# EasyEDA Pro project ProPrj_3x3motorFPGA_V2_1_2025-08-05.epro, board PCB1
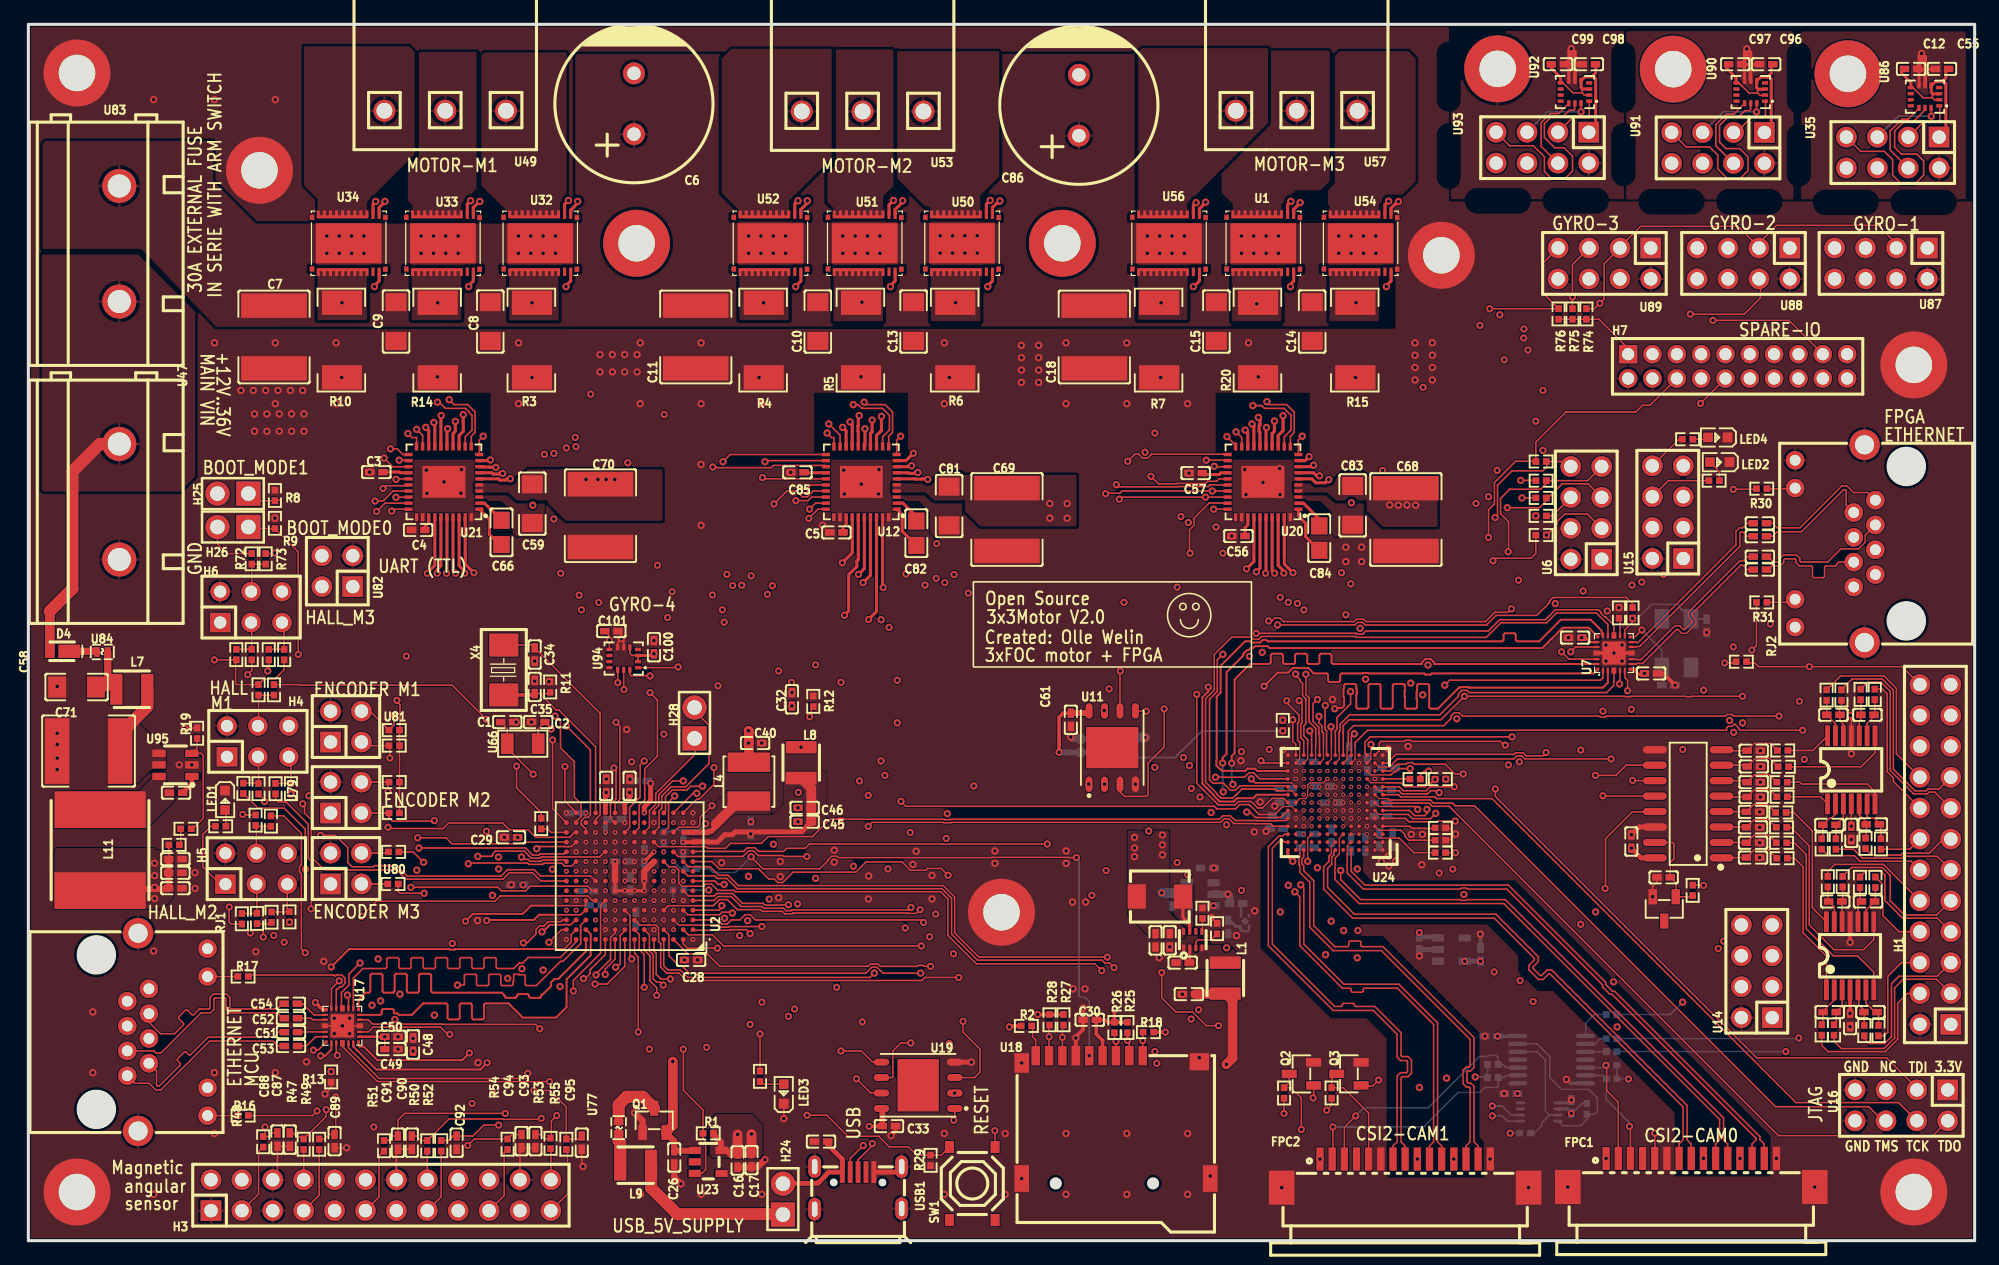
[diagram p6: board, top side]
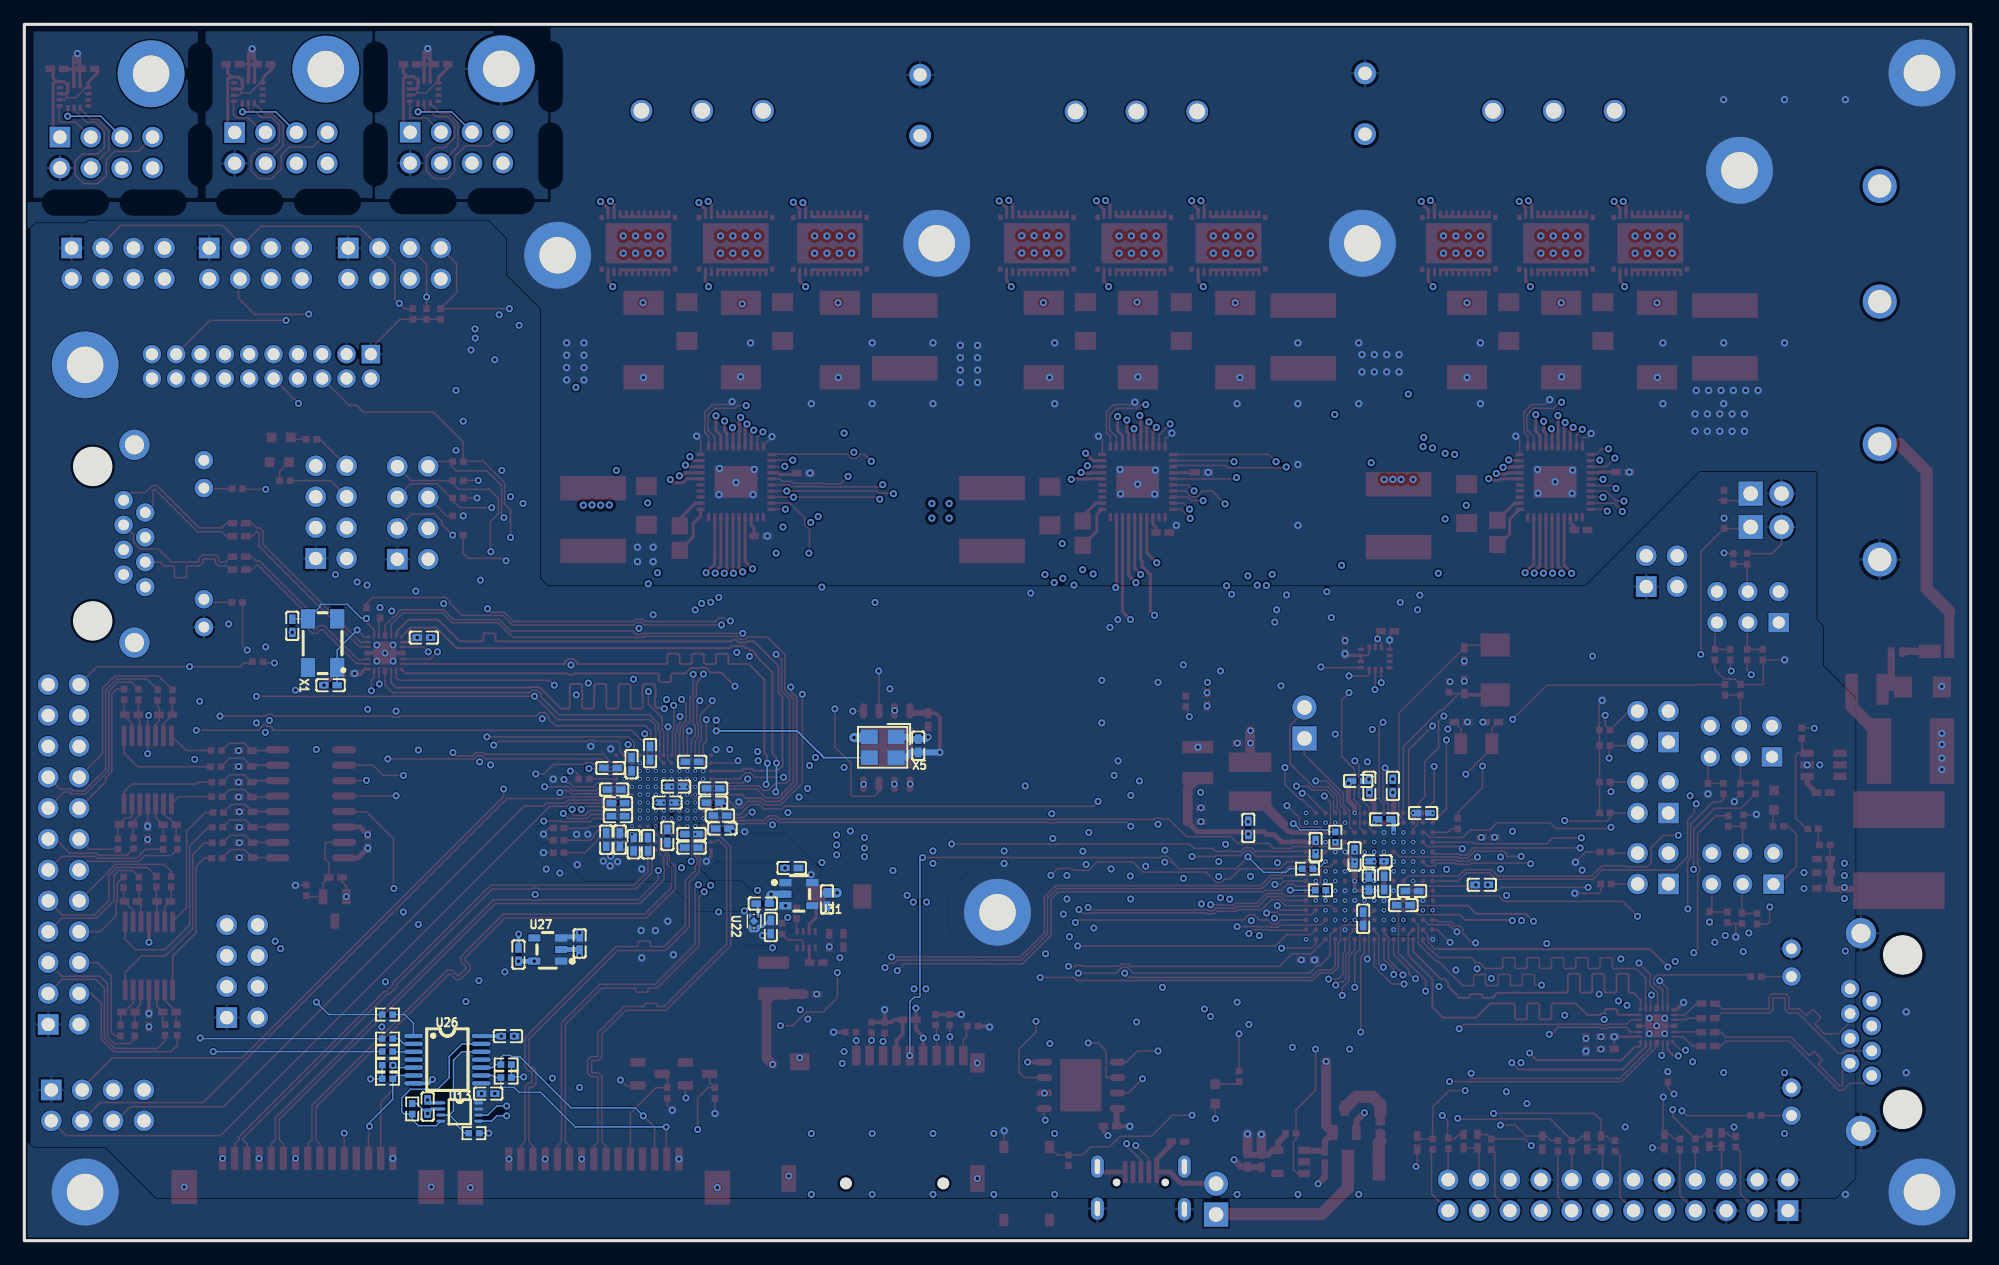
[diagram p7: board, bottom side, seen from below]

Outline 160 x 100 mm; copper layers: Top Layer, Inner1, Inner2, Inner3, Inner4, Bottom Layer. Coordinates in mm from the lower left corner of the outline.
Outline path: rectangle 0,100 160,0
Stack: Top Layer 0.035mm Outer layer thickness 1oz / Dielectric1 0.0994mm 3313 RC57% 4.2mil / Inner1 0.0152mm Inner layer thickness / Dielectric2 0.55mm 0.55mm H/H No copper / Inner2 0.0152mm Inner layer thickness / Dielectric3 0.1088mm 2116 RC54% 4.9mil / Inner3 0.0152mm Inner layer thickness / Dielectric4 0.55mm 0.55mm H/H No copper / Inner4 0.0152mm Inner layer thickness / Dielectric5 0.0994mm 3313 RC57% 4.2mil / Bottom Layer 0.035mm Outer layer thickness 1oz

## Design rules (mm)
net CCM_CLK1_P: CCM_CLK1
net CCM_CLK1_N: CCM_CLK1
net $1I162614\CAM0_D0_N: DP1
net $1I162614\CAM0_D0_P: DP1
net $1I162614\CAM0_D1_P: DP2
net $1I162614\CAM0_D1_N: DP2
net $1I162614\CAM0_CLK_N: DP3
net $1I162614\CAM0_CLK_P: DP3
net $1I162614\CAM1_D1_P: $1I162614\CAM1_D1
net $1I162614\CAM1_D1_N: $1I162614\CAM1_D1
net $1I162614\CAM1_D0_N: DP4
net $1I162614\CAM1_D0_P: DP4
net $1I162614\CAM1_CLK_N: $1I162614\CAM1_CLK
net $1I162614\CAM1_CLK_P: $1I162614\CAM1_CLK
net $1I162614\ETH-F-RD_P: $1I162614\ETH-F-RD
net $1I162614\ETH-FX-RD_P: $1I162614\ETH-FX-RD
net $1I162614\ETH-F-RD_N: $1I162614\ETH-F-RD
net $1I162614\ETH-FX-RD_N: $1I162614\ETH-FX-RD
net $1I162614\ETH-F-TD_N: $1I162614\ETH-F-TD
net $1I162614\ETH-FX-TD_N: $1I162614\ETH-FX-TD
net $1I162614\ETH-F-TD_P: $1I162614\ETH-F-TD
net $1I162614\ETH-FX-TD_P: $1I162614\ETH-FX-TD
net ETH-M-TD_N: ETH-M-TD
net ETH-MX-TD_N: ETH-MX-TD
net ETH-M-RD_P: ETH-M-RD
net ETH-MX-RD_P: ETH-MX-RD
net ETH-M-TD_P: ETH-M-TD
net ETH-MX-TD_P: ETH-MX-TD
net ETH-M-RD_N: ETH-M-RD
net ETH-MX-RD_N: ETH-MX-RD
template: Custom Config
spacing copperThickness1oz (default): track to track 0.127, other pairs 0.127 to 0.3
spacing copperThickness2oz: track to track 0.203, other pairs 0.152 to 0.3
spacing BGA_065_SPACE: track to track 0.105, other pairs 0.1 to 0.3
spacing BGA_08_SPACE: track to track 0.11, other pairs 0.105 to 0.3
track width copperThickness1oz (default): min 0.1, default 0.127, max 2.54
track width copperThickness2oz: min 0.203, default 0.254, max 2.54
track width 50ohm_sing_L1_L2: min 0.1, default 0.157, max 0.25
differential pair differentialPair (default): width min 0.127, default 0.254, max 2.54; gap min 0.152, default 0.152
differential pair differentialPair100ohm_L1_L2: width min 0.1, default 0.122, max 0.127; gap min 0.1, default 0.203
via viaSize (default): diameter min 0.2, default 0.35, max 10; hole min 0.2, default 0.35, max 6.3
net 36V uses copperRegion_36V
net CCM_CLK1_P uses differentialPair100ohm_L1_L2
net CCM_CLK1_N uses differentialPair100ohm_L1_L2
net $1N29938 uses copperRegion_36V
net GND-1 uses copperRegion_36V
net GND-3 uses copperRegion_36V
net ETH_TX_D1 uses 50ohm_sing_L1_L2
net ETH_TX_D0 uses 50ohm_sing_L1_L2
net ETH_XI uses 50ohm_sing_L1_L2
net ETH_RX_D1 uses 50ohm_sing_L1_L2
net ETH_RX_D0 uses 50ohm_sing_L1_L2
net $1I162614\CAM0_D0_N uses differentialPair100ohm_L1_L2
net $1I162614\CAM0_D0_P uses differentialPair100ohm_L1_L2
net $1I162614\CAM0_D1_P uses differentialPair100ohm_L1_L2
net $1I162614\CAM0_D1_N uses differentialPair100ohm_L1_L2
net $1I162614\CAM0_CLK_N uses differentialPair100ohm_L1_L2
net $1I162614\CAM0_CLK_P uses differentialPair100ohm_L1_L2
net $1I162614\CAM1_D1_P uses differentialPair100ohm_L1_L2
net $1I162614\CAM1_D1_N uses differentialPair100ohm_L1_L2
net $1I162614\CAM1_D0_N uses differentialPair100ohm_L1_L2
net $1I162614\CAM1_D0_P uses differentialPair100ohm_L1_L2
net $1I162614\F-ETH-CLK_OUT uses 50ohm_sing_L1_L2
net $1I162614\CAM1_CLK_N uses differentialPair100ohm_L1_L2
net $1I162614\CAM1_CLK_P uses differentialPair100ohm_L1_L2
net $1I162614\F-ETH_TX_D0 uses 50ohm_sing_L1_L2
net $1I162614\F-ETH_RX_D1 uses 50ohm_sing_L1_L2
net $1I162614\F-ETH_TX_D1 uses 50ohm_sing_L1_L2
net $1I162614\F-ETH_RX_D0 uses 50ohm_sing_L1_L2
net $1I162614\ETH-F-RD_P uses differentialPair100ohm_L1_L2
net $1I162614\ETH-FX-RD_P uses differentialPair100ohm_L1_L2
net $1I162614\ETH-F-RD_N uses differentialPair100ohm_L1_L2
net $1I162614\ETH-FX-RD_N uses differentialPair100ohm_L1_L2
net $1I162614\ETH-F-TD_N uses differentialPair100ohm_L1_L2
net $1I162614\ETH-FX-TD_N uses differentialPair100ohm_L1_L2
net $1I162614\ETH-F-TD_P uses differentialPair100ohm_L1_L2
net $1I162614\ETH-FX-TD_P uses differentialPair100ohm_L1_L2
net ETH-M-TD_N uses differentialPair100ohm_L1_L2
net ETH-MX-TD_N uses differentialPair100ohm_L1_L2
net ETH-M-RD_P uses differentialPair100ohm_L1_L2
net ETH-MX-RD_P uses differentialPair100ohm_L1_L2
net ETH-M-TD_P uses differentialPair100ohm_L1_L2
net ETH-MX-TD_P uses differentialPair100ohm_L1_L2
net ETH-M-RD_N uses differentialPair100ohm_L1_L2
net ETH-MX-RD_N uses differentialPair100ohm_L1_L2
diff pair CCM_CLK1 uses differentialPair100ohm_L1_L2
diff pair DP1 uses differentialPair100ohm_L1_L2
diff pair DP2 uses differentialPair100ohm_L1_L2
diff pair DP3 uses differentialPair100ohm_L1_L2
diff pair $1I162614\CAM1_D1 uses differentialPair100ohm_L1_L2
diff pair DP4 uses differentialPair100ohm_L1_L2
diff pair $1I162614\CAM1_CLK uses differentialPair100ohm_L1_L2
diff pair $1I162614\ETH-F-RD uses differentialPair100ohm_L1_L2
diff pair $1I162614\ETH-FX-RD uses differentialPair100ohm_L1_L2
diff pair $1I162614\ETH-F-TD uses differentialPair100ohm_L1_L2
diff pair $1I162614\ETH-FX-TD uses differentialPair100ohm_L1_L2
diff pair ETH-M-TD uses differentialPair100ohm_L1_L2
diff pair ETH-MX-TD uses differentialPair100ohm_L1_L2
diff pair ETH-M-RD uses differentialPair100ohm_L1_L2
diff pair ETH-MX-RD uses differentialPair100ohm_L1_L2
['net', '36v'] ['NET', '3.3V-1'] uses default
pour e3166 uses copperRegion_36V
pour e3154 uses copperRegion_36V
pour e3189 uses copperRegion_36V
pour e3203 uses copperRegion_36V
pour e3228 uses copperRegion_36V
pour e3209 uses copperRegion_36V
pour e3242 uses copperRegion_36V
pour e3249 uses copperRegion_36V
pour e3261 uses copperRegion_36V
pour e3272 uses copperRegion_36V
pour e9346 uses GND_top
region e1839 uses BGA-OUTER_L1-L6-PLANE, BGA_065_SPACE
region e5712 uses BGA-08P-PLANE, BGA_08_SPACE
region e19858 uses BGA-065P-PLANE, BGA_065_SPACE
region e33163 uses BGA-065P-PLANE, BGA_065_SPACE
region e35975 uses BGA-065P-PLANE, BGA_065_SPACE
region e35976 uses BGA-065P-PLANE, BGA_065_SPACE
region e35977 uses BGA-OUTER_L1-L6-PLANE, BGA_065_SPACE
region e35979 uses BGA-OUTER_L1-L6-PLANE, BGA_08_SPACE
region e35980 uses BGA-08P-PLANE, BGA_08_SPACE
pour e15641 uses copperRegion
pour e15643 uses copperRegion
pour e8131 uses copperRegion
pour e18376 uses copperRegion
pour e18377 uses copperRegion
pour e13086 uses copperRegion
pour e18975 uses copperRegion
pour e18976 uses copperRegion
pour e13683 uses copperRegion
pour e17779 uses copperRegion
pour e17780 uses copperRegion
pour e12193 uses copperRegion
pour e14351 uses copperRegion
pour e16438 uses copperRegion
pour e16439 uses copperRegion
pour e15000 uses copperRegion
pour e6384 uses copperRegion
pour e17177 uses copperRegion
pour e17178 uses copperRegion
pour e11628 uses copperRegion

## Placement (name value [footprint] x y rotation side)
C1  12pF  [C0402]  39.37 42.64 0 top
C2  12pF  [C0402]  41.91 42.64 180 top
C3  100nF  [C0402]  28.61 63.19 180 top
C4  4.7uF  [C0402]  32.04 58.43 180 top
C5  4.7uF  [C0402]  66.42 58.23 180 top
C6  1000uF  [CAP-TH_BD13.0-P5.00-D0.6-FD]  49.78 93.47 90 top
C7  22uF  [C2220]  20.19 74.3 90 top
C8  1uF  [C1206]  37.97 75.56 90 top
C9  1uF  [C1206]  30.23 75.56 90 top
C10  1uF  [C1206]  64.9 75.56 90 top
C11  22uF  [C2220]  54.86 74.3 90 top
C12  4.7uF  [C0402]  154.77 96.34 180 top
C13  1uF  [C1206]  72.77 75.56 90 top
C14  1uF  [C1206]  105.54 75.56 90 top
C15  1uF  [C1206]  97.66 75.56 90 top
C16  4.7uF  [C0402]  58.3 6.59 90 top
C17  4.7uF  [C0402]  59.45 6.62 90 top
C18  22uF  [C2220]  87.63 74.3 90 top
C19  100nF  [C0402]  49.94 26.47 90 bottom
C20  100nF  [C0402]  46.63 27.58 0 bottom
C21  100nF  [C0402]  45.01 35.15 0 bottom
C22  100nF  [C0402]  45.92 28.75 0 bottom
C23  100nF  [C0402]  40.18 29.26 0 bottom
C24  100nF  [C0402]  50.65 31.6 270 bottom
C25  100nF  [C0402]  50.34 37.8 0 bottom
C26  100nF  [C0402]  53.1 6.84 90 top
C27  4.7uF  [C0402]  65.16 8.15 0 top
C28  100nF  [C0402]  54.48 23.08 180 top
C29  4.7uF  [C0402]  39.68 33.17 0 top
C30  100nF  [C0402]  87.25 18.16 180 top
C31  100nF  [C0402]  48.21 34.65 180 bottom
C32  100nF  [C0402]  62.77 44.51 90 top
C33  100nF  [C0402]  70.75 9.42 0 top
C34  12pF  [C0402]  41.62 48.19 270 top
C35  12pF  [C0402]  41.62 45.52 90 top
C36  4.7uF  [C0402]  47.5 37.39 270 bottom
C37  100nF  [C0402]  47.5 37.39 270 top
C38  4.7uF  [C0402]  49.43 37.39 270 top
C39  100nF  [C0402]  49.43 37.39 270 bottom
C40  4.7uF  [C0402]  59.74 40.91 0 top
C41  4.7uF  [C0402]  48.21 29.41 90 bottom
C42  4.7uF  [C0402]  48.77 31.19 0 bottom
C43  100nF  [C0402]  49.48 29.36 90 bottom
C44  4.7uF  [C0402]  53.85 32.36 270 bottom
C45  4.7uF  [C0402]  63.82 34.44 180 top
C46  4.7uF  [C0402]  63.82 35.59 180 top
C47  100nF  [C0402]  59.38 33.93 90 bottom
C48  4.7uF  [C0402]  31.62 16.13 90 top
C49  4.7uF  [C0402]  29.84 15.75 0 top
C50  100nF  [C0402]  29.84 16.76 0 top
C51  33nF  [C0402]  21.59 17.15 0 top
C52  33nF  [C0402]  21.59 18.29 0 top
C53  33nF  [C0402]  21.59 16 0 top
C54  33nF  [C0402]  21.57 19.48 0 top
C55  100nF  [C0402]  157.31 96.34 0 top
C56  4.7uF  [C0402]  99.47 57.93 180 top
C57  100nF  [C0402]  95.96 63.11 180 top
C58  1uF  [C1206]  3.96 45.52 0 top
C59  1uF  [C1206]  41.43 60.59 90 top
C60  4.7uF  [C0402]  12.09 30.24 0 top
C61  100nF  [C0402]  85.7 42.82 270 top
C62  4.7uF  [C0402]  12.09 31.37 0 top
C63  4.7uF  [C0402]  12.09 28.97 0 top
C64  100nF  [C0402]  12.14 36.83 180 top
C65  4.7uF  [C0402]  94.89 22.86 0 top
C66  22nF  [C0805]  38.89 58.23 90 top
C67  4.7uF  [C0402]  92.66 24.69 90 top
C68  22uF  [C2220]  113.24 59.28 270 top
C69  22uF  [C2220]  80.45 59.29 270 top
C70  22uF  [C2220]  47.03 59.6 270 top
C71  22uF  [C2220]  4.95 40.25 0 top
C72  4.7uF  [C0402]  93.83 24.69 90 top
C73  100nF  [C0402]  95.4 20.27 180 top
C74  100nF  [C0402]  114.35 24.44 270 bottom
C75  4.7uF  [C0402]  119.38 23.52 270 bottom
C76  100nF  [C0402]  94.02 28.05 90 bottom
C77  4.7uF  [C0402]  96.92 30.64 180 bottom
C78  100nF  [C0402]  98.63 25.79 270 bottom
C79  4.7uF  [C0402]  99.29 27.72 0 bottom
C80  100nF  [C0402]  121.87 12.09 0 bottom
C81  1uF  [C1206]  75.69 60.4 90 top
C82  22nF  [C0805]  73 58.17 90 top
C83  1uF  [C1206]  108.86 60.45 90 top
C84  22nF  [C0805]  106.12 57.76 90 top
C85  100nF  [C0402]  63.22 63.17 180 top
C86  1000uF  [CAP-TH_BD13.0-P5.00-D0.6-FD]  86.36 93.34 90 top
C87  4.7nF  [C0402]  21.49 8.31 270 top
C88  4.7nF  [C0402]  20.47 8.31 270 top
C89  4.7nF  [C0402]  25.17 8.18 270 top
C90  4.7nF  [C0402]  31.52 8.06 270 top
C91  4.7nF  [C0402]  30.38 8.06 270 top
C92  4.7nF  [C0402]  35.21 8.06 270 top
C93  4.7nF  [C0402]  41.68 8.18 270 top
C94  4.7nF  [C0402]  40.54 8.18 270 top
C95  4.7nF  [C0402]  45.49 8.06 270 top
C96  100nF  [C0402]  142.86 96.72 0 top
C97  4.7uF  [C0402]  140.32 96.72 180 top
C98  100nF  [C0402]  128.28 96.72 0 top
C99  4.7uF  [C0402]  125.74 96.72 180 top
C100  100nF  [C0402]  51.43 48.79 270 top
C101  4.7uF  [C0402]  47.92 50.11 180 top
C102  4.7uF  [C0402]  127.15 49.58 180 bottom
C103  4.7uF  [C0402]  133.4 46.63 0 top
C104  100nF  [C0402]  127.15 49.58 180 top
C105  33nF  [C0402]  142.34 56.24 180 top
C106  33nF  [C0402]  142.34 55.17 180 top
C107  33nF  [C0402]  142.34 57.91 180 top
C108  33nF  [C0402]  142.34 58.98 180 top
C109  12pF  [C0402]  137.97 50.55 90 bottom
C110  12pF  [C0402]  134.82 45.67 180 bottom
C111  100nF  [C0402]  86.51 40.69 90 bottom
C112  100nF  [C0402]  149.76 18.14 270 top
C113  100nF  [C0402]  148.08 18.8 0 top
C114  100nF  [C0402]  151.43 18.8 180 top
C115  4.7uF  [C0402]  134.43 29.87 180 top
C116  100nF  [C0402]  151.23 27.89 180 top
C117  100nF  [C0402]  131.77 32.82 270 top
C118  100nF  [C0402]  148.54 27.89 0 top
C119  100nF  [C0402]  149.86 33.53 270 top
C120  100nF  [C0402]  141.83 40.28 0 top
C121  100nF  [C0402]  141.84 38.98 0 top
C122  100nF  [C0402]  141.83 37.69 0 top
C123  100nF  [C0402]  141.83 36.47 0 top
C124  100nF  [C0402]  141.78 35.25 0 top
C125  100nF  [C0402]  141.78 33.98 0 top
C126  100nF  [C0402]  141.78 32.72 0 top
C127  100nF  [C0402]  141.78 31.5 0 top
C128  100nF  [C0402]  148.06 34.19 0 top
C129  100nF  [C0402]  151.63 34.23 180 top
C130  100nF  [C0402]  151.18 43.23 180 top
C131  100nF  [C0402]  148.39 43.23 0 top
C132  4.7uF  [C0402]  109.91 32.59 90 bottom
C133  100nF  [C0402]  103.38 36.02 180 bottom
C134  100nF  [C0402]  111.2 35.97 0 bottom
C135  4.7uF  [C0402]  105.16 33.43 0 bottom
C136  4.7uF  [C0402]  102.62 33.88 0 bottom
C137  100nF  [C0402]  102.82 34.95 180 bottom
C138  4.7uF  [C0402]  107.14 33.27 90 bottom
C139  100nF  [C0402]  105.16 32.31 180 bottom
C140  4.7uF  [C0402]  107.14 36.02 180 bottom
C141  100nF  [C0402]  108.73 32.59 270 bottom
C142  100nF  [C0402]  111.81 38.86 0 bottom
C143  100nF  [C0402]  111.05 32.97 270 bottom
C144  100nF  [C0402]  110.08 39.17 90 bottom
C145  100nF  [C0402]  112.17 32.97 270 bottom
C146  100nF  [C0402]  108.56 40.08 90 bottom
C147  4.7uF  [C0402]  106.43 37.34 180 bottom
C148  100nF  [C0402]  111.2 34.9 0 bottom
C149  100nF  [C0402]  103.38 37.19 180 bottom
C150  100nF  [C0402]  105.1 39.37 180 bottom
C151  100nF  [C0402]  111.51 37.08 0 bottom
C152  100nF  [C0402]  126.85 11.02 270 bottom
C153  100nF  [C0402]  120.24 16.81 0 bottom
D4  RB160VAM-60TR  [TUMD2M_L2.0-W1.4-LS2.5-RD]  2.56 48.46 180 top
FPC1  52271-1569  [FFC-SMD_15P-P1.00_522711569]  136.7 5.59 0 top
FPC2  52271-1569  [FFC-SMD_15P-P1.00_522711569]  113.18 5.54 0 top
H1  HX PZ2.54-2x12P ZZ  [HDR-TH_24P-P2.54-V-M-R2-C12-S2.54]  156.77 31.75 90 top
H3  HX PZ2.54-2x12P ZZ  [HDR-TH_24P-P2.54-V-M-R2-C12-S2.54]  28.98 3.74 0 top
H4  排母/2.54mm2x3直排母袋装环保  [HDR-TH_6P-P2.54-V-F-R2-C3-S2.54]  18.87 41.05 0 top
H5  排母/2.54mm2x3直排母袋装环保  [HDR-TH_6P-P2.54-V-F-R2-C3-S2.54]  18.74 30.58 0 top
H6  排母/2.54mm2x3直排母袋装环保  [HDR-TH_6P-P2.54-V-F-R2-C3-S2.54]  18.31 52.09 0 top
H7  2.0-210-SMT-Pin  [HDR-TH_20P-P2.00-V-F-R2-C10-S2.00]  140.51 71.88 0 top
H24  PZ254-1-02-Z-8.5  [HDR-TH_2P-P2.54-V-M]  62.03 3.42 90 top
H25  PZ254-1-02-Z-8.5  [HDR-TH_2P-P2.54-V-M]  16.81 61.42 180 top
H26  PZ254-1-02-Z-8.5  [HDR-TH_2P-P2.54-V-M]  16.81 58.67 180 top
H28  PZ254-1-02-Z-8.5  [HDR-TH_2P-P2.54-V-M]  54.76 42.56 90 top
L1  120nH  [IND-SMD_L2.9-W2.5]  98.4 21.59 270 top
L4  4.7uH  [IND-SMD_L4.0-W4.0]  59.23 37.74 90 top
L7  120nH  [IND-SMD_L2.9-W2.5]  8.5 45.33 180 top
L8  120nH  [IND-SMD_L2.9-W2.5]  63.53 39.3 90 top
L9  120nH  [IND-SMD_L2.9-W2.5]  49.92 6.21 180 top
L11  33uH  [IND-SMD_L8.0-W8.0]  5.89 32.11 90 top
LED1  KT-0603R  [LED0603-RD]  16.17 36.21 270 top
LED2  KT-0603R  [LED0603-RD]  139.04 64.01 180 top
LED3  KT-0603R  [LED0603-RD]  62.1 12.06 90 top
LED4  KT-0603R  [LED0603-RD]  138.89 66.04 180 top
NOREF  -  [Pad_e323]  149.58 95.94 180 top
NOREF#2  -  [Pad_e39]  50 82 0 top
NOREF#3  -  [Pad_e242]  4 4 0 top
NOREF#4  -  [Pad_e93]  85 82 0 top
NOREF#5  -  [Pad_e511]  155 72 0 top
NOREF#6  -  [Pad_e238]  4 96 0 top
NOREF#7  -  [Pad_e94]  116.16 81.01 0 top
NOREF#8  -  [Pad_e32]  19 88 0 top
NOREF#9  -  [Pad_e320]  120.79 96.34 180 top
NOREF#10  -  [Pad_e240]  155 4 0 top
NOREF#11  -  [Pad_e321]  135.22 96.32 180 top
NOREF#12  -  [Pad_e450]  80 27 0 top
Q1  DMG2305UX-7  [SOT-23-3_L2.9-W1.3-P1.90-LS2.4-BR]  51.44 9.89 270 top
Q2  BSS138  [SOT-23-3_L2.9-W1.3-P1.90-LS2.4-BR-1]  104.66 13.71 0 top
Q3  BSS138  [SOT-23-3_L2.9-W1.3-P1.90-LS2.4-BR-1]  108.56 13.72 0 top
R1  100kΩ  [R0402]  55.89 8.83 0 top
R2  100kΩ  [R0402]  82.04 17.65 180 top
R3  20mΩ  [RES-SMD_L6.4-W3.2-R2512]  41.4 74.04 90 top
R4  20mΩ  [RES-SMD_L6.4-W3.2-R2512]  60.45 74.04 90 top
R5  20mΩ  [RES-SMD_L6.4-W3.2-R2512]  68.45 74.04 90 top
R6  20mΩ  [RES-SMD_L6.4-W3.2-R2512]  76.2 74.04 90 top
R7  20mΩ  [RES-SMD_L6.4-W3.2-R2512]  92.96 74.04 90 top
R8  47kΩ  [R0402]  20.27 61.27 90 top
R9  47kΩ  [R0402]  20.27 58.98 270 top
R10  20mΩ  [RES-SMD_L6.4-W3.2-R2512]  25.78 74.04 90 top
R11  2.2MΩ  [R0402]  42.89 45.52 90 top
R12  1kΩ  [R0402]  64.53 44.34 270 top
R13  6.49kΩ  [R0402]  24.89 13.46 90 top
R14  20mΩ  [RES-SMD_L6.4-W3.2-R2512]  33.66 74.04 90 top
R15  20mΩ  [RES-SMD_L6.4-W3.2-R2512]  109.09 74.04 90 top
R16  150Ω  [R0402]  17.65 10.29 0 top
R17  150Ω  [R0402]  17.65 21.72 0 top
R18  47kΩ  [R0402]  92.07 17.15 0 top
R19  20kΩ  [R0402]  13.87 41.72 270 top
R20  20mΩ  [RES-SMD_L6.4-W3.2-R2512]  101.09 74.04 90 top
R21  100kΩ  [R0402]  11.98 32.54 180 top
R22  4.7kΩ  [R0402]  12.95 33.86 180 top
R23  4.7kΩ  [R0402]  103.23 12.14 90 top
R24  6.49kΩ  [R0402]  130.76 51.61 270 top
R25  47kΩ  [R0402]  90.35 17.53 90 top
R26  47kΩ  [R0402]  89.28 17.53 90 top
R27  47kΩ  [R0402]  85.09 18.16 90 top
R28  47kΩ  [R0402]  83.95 18.16 90 top
R29  47kΩ  [R0402]  74.17 6.6 90 top
R30  150Ω  [R0402]  142.49 61.82 180 top
R31  150Ω  [R0402]  142.49 52.48 180 top
R32  22Ω  [R0402]  131.88 51.61 90 top
R33  470Ω  [R0402]  147.42 17.32 270 top
R34  150Ω  [R0402]  144.07 35.2 180 top
R35  4.7kΩ  [R0402]  128.11 10.83 90 bottom
R36  4.7kΩ  [R0402]  123.04 8.84 180 bottom
R37  4.7kΩ  [R0402]  130.15 14.43 0 bottom
R38  4.7kΩ  [R0402]  130.15 13.31 0 bottom
R39  4.7kΩ  [R0402]  120.39 13.41 180 bottom
R40  1kΩ  [R0402]  29.98 29.32 180 top
R41  1kΩ  [R0402]  30.08 35.17 180 top
R42  1kΩ  [R0402]  30.08 40.7 180 top
R43  1kΩ  [R0402]  30.08 41.97 180 top
R44  1kΩ  [R0402]  30.08 37.7 180 top
R45  1kΩ  [R0402]  30.03 31.96 180 top
R46  4.7kΩ  [R0402]  120.39 14.48 180 bottom
R47  4.7kΩ  [R0402]  22.63 7.93 270 top
R48  4.7kΩ  [R0402]  19.3 8.13 270 top
R49  4.7kΩ  [R0402]  23.9 7.93 270 top
R50  4.7kΩ  [R0402]  32.79 7.8 270 top
R51  4.7kΩ  [R0402]  29.24 7.8 270 top
R52  4.7kΩ  [R0402]  33.94 7.8 270 top
R53  4.7kΩ  [R0402]  42.93 8 270 top
R54  4.7kΩ  [R0402]  39.4 7.93 270 top
R55  4.7kΩ  [R0402]  44.22 7.93 270 top
R56  4.7kΩ  [R0402]  18.92 37.16 270 top
R57  1kΩ  [R0402]  17.68 37.19 90 top
R58  4.7kΩ  [R0402]  21.59 37.16 270 top
R59  1kΩ  [R0402]  20.32 37.16 90 top
R60  4.7kΩ  [R0402]  18.92 45.29 90 top
R61  1kΩ  [R0402]  20.19 45.29 270 top
R62  4.7kΩ  [R0402]  18.8 26.49 270 top
R63  1kΩ  [R0402]  17.55 26.46 90 top
R64  4.7kΩ  [R0402]  19.99 26.59 270 top
R65  1kΩ  [R0402]  21.46 26.62 90 top
R66  4.7kΩ  [R0402]  18.68 34.57 90 top
R67  1kΩ  [R0402]  19.94 34.49 270 top
R68  4.7kΩ  [R0402]  17.09 48.18 270 top
R69  1kΩ  [R0402]  18.36 48.18 90 top
R70  4.7kΩ  [R0402]  21.03 48.18 270 top
R71  1kΩ  [R0402]  19.76 48.18 90 top
R72  4.7kΩ  [R0402]  18.36 56.06 90 top
R73  1kΩ  [R0402]  19.51 56.06 270 top
R74  4.7kΩ  [R0402]  128.08 76.19 90 top
R75  4.7kΩ  [R0402]  126.94 76.19 90 top
R76  4.7kΩ  [R0402]  125.79 76.19 90 top
R77  22Ω  [R0402]  116.08 32.92 0 top
R78  22Ω  [R0402]  116.08 33.93 0 top
R79  10kΩ  [R0402]  116.08 37.95 0 top
R80  22Ω  [R0402]  42.16 34.29 90 top
R81  22Ω  [R0402]  53.44 28.8 0 bottom
R82  10kΩ  [R0402]  96.52 26.92 270 top
R83  4.7kΩ  [R0402]  97.72 25.65 270 top
R84  4.7kΩ  [R0402]  107.14 12.14 90 top
R85  4.7kΩ  [R0402]  130.15 16.61 180 bottom
R86  4.7kΩ  [R0402]  130.15 15.54 180 bottom
R87  10kΩ  [R0402]  116.08 31.9 0 top
R88  4.7kΩ  [R0402]  130.15 18.59 180 bottom
R89  470Ω  [R0402]  138.58 62.48 180 top
R90  470Ω  [R0402]  136.4 65.89 180 top
R91  22Ω  [R0402]  54.51 30.58 180 bottom
R94  22Ω  [R0402]  103.12 42.37 270 top
R95  470Ω  [R0402]  60.15 13.51 90 top
R96  470Ω  [R0402]  15.81 34.07 180 top
R97  470Ω  [R0402]  148.44 17.32 270 top
R98  470Ω  [R0402]  152.09 17.27 270 top
R99  470Ω  [R0402]  150.93 17.27 270 top
R100  470Ω  [R0402]  151.84 29.46 90 top
R101  470Ω  [R0402]  150.57 29.46 90 top
R102  470Ω  [R0402]  147.93 29.51 90 top
R103  470Ω  [R0402]  149.15 29.51 90 top
R104  470Ω  [R0402]  147.42 32.61 270 top
R105  470Ω  [R0402]  148.59 32.61 270 top
R106  470Ω  [R0402]  152.3 32.61 270 top
R107  470Ω  [R0402]  151.03 32.66 270 top
R108  470Ω  [R0402]  151.79 44.91 90 top
R109  470Ω  [R0402]  150.62 44.91 90 top
R110  470Ω  [R0402]  147.83 44.86 90 top
R111  470Ω  [R0402]  149.05 44.86 90 top
R112  150Ω  [R0402]  144.17 36.49 180 top
R113  150Ω  [R0402]  144.17 31.44 180 top
R114  150Ω  [R0402]  144.12 32.72 180 top
R115  150Ω  [R0402]  144.12 33.98 180 top
R116  150Ω  [R0402]  144.17 37.69 180 top
R117  150Ω  [R0402]  144.27 38.96 180 top
R118  150Ω  [R0402]  144.22 40.3 180 top
R119  470Ω  [R0402]  136.82 28.8 270 top
R120  22Ω  [R0402]  140.82 47.6 180 top
R121  22Ω  [R0402]  124.36 58.01 180 top
R122  22Ω  [R0402]  124.36 61.06 180 top
R123  22Ω  [R0402]  124.36 62.48 180 top
R124  22Ω  [R0402]  124.36 59.59 180 top
R125  22Ω  [R0402]  124.36 64.06 180 top
R126  22Ω  [R0402]  52.22 33.17 270 bottom
R127  22Ω  [R0402]  114 37.95 0 top
RJ1  RJHSE5384  [RJ45-TH_RJHSE5384]  11.43 17.15 270 top
RJ2  RJHSE5384  [RJ45-TH_RJHSE5384]  148.54 57.3 90 top
SW1  TS-1187A-B-A-B  [SW-SMD_4P-L5.1-W5.1-P3.70-LS6.5-TL_H1.5]  77.6 4.7 90 top
U1  CSD88599Q5DC  [SON-22_L5.0-W6.0-P0.50-CSD88599Q5DCT]  101.52 82 270 top
U2  MIMXRT1062DVJ6B  [LFBGA-196_L12.0-W12.0-R14-C14-P0.80-BL]  49.43 29.97 90 top
U3  INA4180A3QPWRQ1  [TSSOP-14_L5.0-W4.4-P0.65-LS6.4-BL]  149.76 23.42 0 top
U4  LM4040EEM3-2.5/NOPB  [SOT-23-3_L2.9-W1.3-P1.90-LS2.4-BR]  134.48 27.28 90 top
U5  MCP3208T-CI/SL  [SOIC-16_L9.9-W3.9-P1.27-LS6.0-BL]  136.45 35.92 90 top
U6  PZ2.54-2*4  [HDR-TH_8P-P2.54-V-M-R2-C4-S2.54]  128.07 59.84 90 top
U7  DP83825IRMQR  [HVQFN-24_L3.0-W3.0-P0.40-TL-EP1.9]  130.35 48.31 90 top
U9  TPS62840DLCR  [VSON-8_L2.0-W1.5-P0.50-BL]  95.72 24.75 0 top
U10  2.2uH  [IND-SMD_L4.7-W4.2]  93.01 28.3 180 top
U11  W25Q64JVZPIQ  [WSON-8_L6.0-W5.0-P1.27-BL-EP]  89.1 40.54 0 top
U12  DRV8304SRHAR  [VQFN-40_L6.0-W6.0-P0.50-TL-EP]  68.47 62.38 180 top
U13  PCA9306DC1  [VSSOP-8_L2.4-W2.1-P0.50-LS3.2-BR]  124.2 10.58 0 bottom
U14  PZ2.54-2*4  [HDR-TH_8P-P2.54-V-M-R2-C4-S2.54]  142.09 22.15 90 top
U15  PZ2.54-2*4  [HDR-TH_8P-P2.54-V-M-R2-C4-S2.54]  134.77 59.89 90 top
U16  PZ2.54-2*4  [HDR-TH_8P-P2.54-V-M-R2-C4-S2.54]  153.97 11.12 180 top
U17  DP83825IRMQR  [HVQFN-24_L3.0-W3.0-P0.40-TL-EP1.9]  25.81 17.66 270 top
U18  A-MicroTF-1.85A  [TF-SMD_A-MICROTF-1.85A]  89.41 10.16 0 top
U19  W25Q64JVZPIQ  [WSON-8_L6.0-W5.0-P1.27-BL-EP]  73.15 12.78 90 top
U20  DRV8304SRHAR  [VQFN-40_L6.0-W6.0-P0.50-TL-EP]  101.5 62.38 180 top
U21  DRV8304SRHAR  [VQFN-40_L6.0-W6.0-P0.50-TL-EP]  34.16 62.38 180 top
U22  TLV75525PDQNR  [X2SON-4_L1.0-W1.0-P0.65-TL-EP]  100.01 26.27 270 bottom
U23  TLV75733PDBVR  [SOT-23-5_L2.9-W1.6-P0.95-LS2.8-BL]  55.89 6.47 270 top
U24  T20F169C4  [FBGA-169_L9.0-W9.0-R13-C13-P0.65-TL]  107.44 36.02 180 top
U25  INA4180A3QPWRQ1  [TSSOP-14_L5.0-W4.4-P0.65-LS6.4-BL]  149.86 38.71 0 top
U26  PCA9542APW/DG118  [TSSOP-14_L4.9-W4.4-P0.65-LS6.4-BL]  125.22 14.88 270 bottom
U27  TLV75512PDBVR  [SOT-23-5_L2.9-W1.6-P0.95-LS2.8-BR]  116.97 23.94 180 bottom
U31  TLV75518PDBVR  [SOT-23-5_L2.9-W1.6-P0.95-LS2.8-BR]  96.33 28.49 0 bottom
U32  CSD88599Q5DC  [SON-22_L5.0-W6.0-P0.50-CSD88599Q5DCT]  42.08 82 270 top
U33  CSD88599Q5DC  [SON-22_L5.0-W6.0-P0.50-CSD88599Q5DCT]  34.08 82 270 top
U34  CSD88599Q5DC  [SON-22_L5.0-W6.0-P0.50-CSD88599Q5DCT]  26.33 82 270 top
U35  PZ2.54-2*4  [HDR-TH_8P-P2.54-V-M-R2-C4-S2.54]  153.26 89.46 180 top
U47  MX950T-9.5-02P-GN01-Cu-PS-A  [CONN-TH_2P-P9.50_DB910-9.52-2P]  7.47 60.75 270 top
U49  KF332K-5.0-3P  [CONN-TH_KF332K-5.0-3P]  34.27 92.9 180 top
U50  CSD88599Q5DC  [SON-22_L5.0-W6.0-P0.50-CSD88599Q5DCT]  76.75 82 270 top
U51  CSD88599Q5DC  [SON-22_L5.0-W6.0-P0.50-CSD88599Q5DCT]  68.75 82 270 top
U52  CSD88599Q5DC  [SON-22_L5.0-W6.0-P0.50-CSD88599Q5DCT]  61 82 270 top
U53  KF332K-5.0-3P  [CONN-TH_KF332K-5.0-3P]  68.58 92.84 180 top
U54  CSD88599Q5DC  [SON-22_L5.0-W6.0-P0.50-CSD88599Q5DCT]  109.52 82 270 top
U56  CSD88599Q5DC  [SON-22_L5.0-W6.0-P0.50-CSD88599Q5DCT]  93.77 82 270 top
U57  KF332K-5.0-3P  [CONN-TH_KF332K-5.0-3P]  104.27 92.9 180 top
U66  32.768kHz  [CRYSTAL-SMD_L3.2-W1.5-2]  40.64 40.86 0 top
U77  0ABA-0500-TN  [F0402]  48.53 9.29 270 top
U79  PZ2.54-2*2  [HDR-TH_4P-P2.54-V-M-R2-C2-S2.54]  26.11 36.43 0 top
U80  PZ2.54-2*2  [HDR-TH_4P-P2.54-V-M-R2-C2-S2.54]  26.11 30.6 0 top
U81  PZ2.54-2*2  [HDR-TH_4P-P2.54-V-M-R2-C2-S2.54]  26.11 42.26 0 top
U82  PZ2.54-2*2  [HDR-TH_4P-P2.54-V-M-R2-C2-S2.54]  25.4 55.04 90 top
U83  MX950T-9.5-02P-GN01-Cu-PS-A  [CONN-TH_2P-P9.50_DB910-9.52-2P]  7.47 81.96 270 top
U84  0ABA-0500-TN  [F0402]  6.08 48.4 0 top
U86  ASM330LHHTR  [LGA-14L_L3.0-W2.5-P0.50-TL]  155.91 94.05 180 top
U87  PZ2.54-2*4  [HDR-TH_8P-P2.54-V-M-R2-C4-S2.54]  152.3 80.34 180 top
U88  PZ2.54-2*4  [HDR-TH_8P-P2.54-V-M-R2-C4-S2.54]  141 80.34 180 top
U89  PZ2.54-2*4  [HDR-TH_8P-P2.54-V-M-R2-C4-S2.54]  129.56 80.34 180 top
U90  ASM330LHHTR  [LGA-14L_L3.0-W2.5-P0.50-TL]  141.59 94.43 180 top
U91  PZ2.54-2*4  [HDR-TH_8P-P2.54-V-M-R2-C4-S2.54]  138.9 89.84 180 top
U92  ASM330LHHTR  [LGA-14L_L3.0-W2.5-P0.50-TL]  127.14 94.43 180 top
U93  PZ2.54-2*4  [HDR-TH_8P-P2.54-V-M-R2-C4-S2.54]  124.47 89.86 180 top
U94  ASM330LHHTR  [LGA-14L_L3.0-W2.5-P0.50-TL]  48.94 47.86 180 top
U95  LMR51610XDBVR  [SOT-23-6_L2.9-W1.6-P0.95-LS2.8-BR]  12.09 39.12 0 top
USB1  051N-4BH806-S  [MICRO-USB-SMD_051N-4BH806-S]  68.21 4.34 0 top
X1  25MHz  [CRYSTAL-SMD_4P-L5.0-W3.2-BL]  135.48 49.12 90 bottom
X4  24MHz  [OSC-SMD_L5.0-W3.2]  39.08 46.92 270 top
X5  50MHz  [OSC-SMD_4P-L3.2-W2.5-BL-OXETDLJANF-0.032768MHZ]  89.44 40.56 0 bottom

## Footprints (pads in the part's own frame, mm; a bottom-side part is the same pattern mirrored in y, then rotated)
C0402
  rect 0.79x0.54 smd: 1(-0.545,0) 2(0.545,0)
C0805
  rect 1.41x1.35 smd: 1(-1,0) 2(1,0)
C1206
  rect 1.485x1.728 smd: 1(-1.593,0) 2(1.593,0)
C2220
  rect 2.01x5.4 smd: 1(-2.58,0) 2(2.58,0)
CAP-TH_BD13.0-P5.00-D0.6-FD
  round 1.8 hole 1.1: 1(-2.5,0) 2(2.5,0)
CONN-TH_2P-P9.50_DB910-9.52-2P
  round 2.8 hole 1.9: 1(-4.75,0) 2(4.75,0)
CONN-TH_KF332K-5.0-3P
  round 1.8 hole 1.3: 1(-5,0) 2(0,0) 3(5,0)
CRYSTAL-SMD_4P-L5.0-W3.2-BL
  rect 1.6x1.2 smd: 1(-2,-1.2) 2(2,-1.2) 3(2,1.2) 4(-2,1.2)
CRYSTAL-SMD_L3.2-W1.5-2
  rect 1.05x1.7 smd: 1(-1.27,0) 2(1.27,0)
F0402
  rect 0.5x0.8 smd: 1(-0.45,0) 2(0.45,0)
FBGA-169_L9.0-W9.0-R13-C13-P0.65-TL
  round 0.32 smd: A1(-3.9,3.9) A2(-3.25,3.9) A3(-2.6,3.9) A4(-1.95,3.9) A5(-1.3,3.9) A6(-0.65,3.9) A7(0,3.9) A8(0.65,3.9) A9(1.3,3.9) A10(1.95,3.9) A11(2.6,3.9) A12(3.25,3.9) A13(3.9,3.9) B1(-3.9,3.25) B2(-3.25,3.25) B3(-2.6,3.25) B4(-1.95,3.25) B5(-1.3,3.25) B6(-0.65,3.25) B7(0,3.25) B8(0.65,3.25) B9(1.3,3.25) B10(1.95,3.25) B11(2.6,3.25) B12(3.25,3.25) B13(3.9,3.25) C1(-3.9,2.6) C2(-3.25,2.6) C3(-2.6,2.6) C4(-1.95,2.6) C5(-1.3,2.6) C6(-0.65,2.6) C7(0,2.6) C8(0.65,2.6) C9(1.3,2.6) C10(1.95,2.6) C11(2.6,2.6) C12(3.25,2.6) C13(3.9,2.6) D1(-3.9,1.95) D2(-3.25,1.95) D3(-2.6,1.95) D4(-1.95,1.95) D5(-1.3,1.95) D6(-0.65,1.95) D7(0,1.95) D8(0.65,1.95) D9(1.3,1.95) D10(1.95,1.95) D11(2.6,1.95) D12(3.25,1.95) D13(3.9,1.95) E1(-3.9,1.3) E2(-3.25,1.3) E3(-2.6,1.3) E4(-1.95,1.3) E5(-1.3,1.3) E6(-0.65,1.3) E7(0,1.3) E8(0.65,1.3) E9(1.3,1.3) E10(1.95,1.3) E11(2.6,1.3) E12(3.25,1.3) E13(3.9,1.3) F1(-3.9,0.65) F2(-3.25,0.65) F3(-2.6,0.65) F4(-1.95,0.65) F5(-1.3,0.65) F6(-0.65,0.65) F7(0,0.65) F8(0.65,0.65) F9(1.3,0.65) F10(1.95,0.65) F11(2.6,0.65) F12(3.25,0.65) F13(3.9,0.65) G1(-3.9,0) G2(-3.25,0) G3(-2.6,0) G4(-1.95,0) G5(-1.3,0) G6(-0.65,0) G7(0,0) G8(0.65,0) G9(1.3,0) G10(1.95,0) G11(2.6,0) G12(3.25,0) G13(3.9,0) H1(-3.9,-0.65) H2(-3.25,-0.65) H3(-2.6,-0.65) H4(-1.95,-0.65) H5(-1.3,-0.65) H6(-0.65,-0.65) H7(0,-0.65) H8(0.65,-0.65) H9(1.3,-0.65) H10(1.95,-0.65) H11(2.6,-0.65) H12(3.25,-0.65) H13(3.9,-0.65) J1(-3.9,-1.3) J2(-3.25,-1.3) J3(-2.6,-1.3) J4(-1.95,-1.3) J5(-1.3,-1.3) J6(-0.65,-1.3) J7(0,-1.3) J8(0.65,-1.3) J9(1.3,-1.3) J10(1.95,-1.3) J11(2.6,-1.3) J12(3.25,-1.3) J13(3.9,-1.3) K1(-3.9,-1.95) K2(-3.25,-1.95) K3(-2.6,-1.95) K4(-1.95,-1.95) K5(-1.3,-1.95) K6(-0.65,-1.95) K7(0,-1.95) K8(0.65,-1.95) K9(1.3,-1.95) K10(1.95,-1.95) K11(2.6,-1.95) K12(3.25,-1.95) K13(3.9,-1.95) L1(-3.9,-2.6) L2(-3.25,-2.6) L3(-2.6,-2.6) L4(-1.95,-2.6) L5(-1.3,-2.6) L6(-0.65,-2.6) L7(0,-2.6) L8(0.65,-2.6) L9(1.3,-2.6) L10(1.95,-2.6) L11(2.6,-2.6) L12(3.25,-2.6) L13(3.9,-2.6) M1(-3.9,-3.25) M2(-3.25,-3.25) M3(-2.6,-3.25) M4(-1.95,-3.25) M5(-1.3,-3.25) M6(-0.65,-3.25) M7(0,-3.25) M8(0.65,-3.25) M9(1.3,-3.25) M10(1.95,-3.25) M11(2.6,-3.25) M12(3.25,-3.25) M13(3.9,-3.25) N1(-3.9,-3.9) N2(-3.25,-3.9) N3(-2.6,-3.9) N4(-1.95,-3.9) N5(-1.3,-3.9) N6(-0.65,-3.9) N7(0,-3.9) N8(0.65,-3.9) N9(1.3,-3.9) N10(1.95,-3.9) N11(2.6,-3.9) N12(3.25,-3.9) N13(3.9,-3.9)
FFC-SMD_15P-P1.00_522711569
  rect 0.6x1.9 smd: 1(-7,1.175) 2(-6,1.175) 3(-5,1.175) 4(-4,1.175) 5(-3,1.175) 6(-2,1.175) 7(-1,1.175) 8(0,1.175) 9(1,1.175) 10(2,1.175) 11(3,1.175) 12(4,1.175) 13(5,1.175) 14(6,1.175) 15(7,1.175)
  rect 2.1x2.8 smd: 16(10.15,-1.175) 17(-10.15,-1.175)
HDR-TH_2P-P2.54-V-M
  rect 2x2 hole 1.2: 1(-1.27,0)
  round 2 hole 1.2: 2(1.27,0)
HDR-TH_4P-P2.54-V-M-R2-C2-S2.54
  rect 1.7x1.7 hole 1.1: 1(-1.27,-1.27)
  round 1.7 hole 1.1: 2(-1.27,1.27) 3(1.27,-1.27) 4(1.27,1.27)
HDR-TH_6P-P2.54-V-F-R2-C3-S2.54
  rect 1.7x1.6 hole 1: 1(-2.54,-1.27)
  round 1.6 hole 1: 2(-2.54,1.27) 3(0,-1.27) 4(0,1.27) 5(2.54,-1.27) 6(2.54,1.27)
HDR-TH_8P-P2.54-V-M-R2-C4-S2.54
  rect 1.7x1.7 hole 1.1: 1(-3.81,-1.27)
  round 1.7 hole 1.1: 2(-3.81,1.27) 3(-1.27,-1.27) 4(-1.27,1.27) 5(1.27,-1.27) 6(1.27,1.27) 7(3.81,-1.27) 8(3.81,1.27)
HDR-TH_20P-P2.00-V-F-R2-C10-S2.00
  rect 1.524x1.524 hole 1: 1(-9,1)
  round 1.524 hole 1: 2(-9,-1) 3(-7,1) 4(-7,-1) 5(-5,1) 6(-5,-1) 7(-3,1) 8(-3,-1) 9(-1,1) 10(-1,-1) 11(1,1) 12(1,-1) 13(3,1) 14(3,-1) 15(5,1) 16(5,-1) 17(7,1) 18(7,-1) 19(9,1) 20(9,-1)
HDR-TH_24P-P2.54-V-M-R2-C12-S2.54
  rect 1.7x1.7 hole 1.1: 1(-13.97,-1.27)
  round 1.7 hole 1.1: 2(-13.97,1.27) 3(-11.43,-1.27) 4(-11.43,1.27) 5(-8.89,-1.27) 6(-8.89,1.27) 7(-6.35,-1.27) 8(-6.35,1.27) 9(-3.81,-1.27) 10(-3.81,1.27) 11(-1.27,-1.27) 12(-1.27,1.27) 13(1.27,-1.27) 14(1.27,1.27) 15(3.81,-1.27) 16(3.81,1.27) 17(6.35,-1.27) 18(6.35,1.27) 19(8.89,-1.27) 20(8.89,1.27) 21(11.43,-1.27) 22(11.43,1.27) 23(13.97,-1.27) 24(13.97,1.27)
HVQFN-24_L3.0-W3.0-P0.40-TL-EP1.9
  oval 0.525x0.2 smd: 1(-1.438,0.9) 2(-1.438,0.5) 4(-1.438,-0.5) 5(-1.438,-0.9) 13(1.438,-0.9) 14(1.438,-0.5) 16(1.438,0.5) 17(1.438,0.9)
  rect 0.525x0.4 smd: 3(-1.438,0) 15(1.438,0)
  rect 0.25x0.25 smd: 6(-1.325,-1.325) 12(1.325,-1.325) 18(1.325,1.325) 24(-1.325,1.325)
  oval 0.2x0.525 smd: 7(-0.9,-1.438) 8(-0.5,-1.438) 10(0.5,-1.438) 11(0.9,-1.438) 19(0.9,1.438) 20(0.5,1.438) 22(-0.5,1.438) 23(-0.9,1.438)
  rect 0.4x0.525 smd: 9(0,-1.438) 21(0,1.438)
  rect 1.9x1.9 smd: 25(0,0)
IND-SMD_L2.9-W2.5
  rect 1.02x2.54 smd: 1(-1.27,0) 2(1.27,0)
IND-SMD_L4.0-W4.0
  rect 1.6x3.5 smd: 1(-1.6,0) 2(1.6,0)
IND-SMD_L4.7-W4.2
  rect 1.5x2 smd: 1(-1.9,0) 2(1.9,0)
IND-SMD_L8.0-W8.0
  rect 3.024x7.5 smd: 1(3.328,0) 2(-3.328,0)
LED0603-RD
  rect 0.8x0.8 smd: 1(-0.799,0) 2(0.799,0)
LFBGA-196_L12.0-W12.0-R14-C14-P0.80-BL
  round 0.4 smd: A1(-5.2,-5.2) A2(-5.2,-4.4) A3(-5.2,-3.6) A4(-5.2,-2.8) A5(-5.2,-2) A6(-5.2,-1.2) A7(-5.2,-0.4) A8(-5.2,0.4) A9(-5.2,1.2) A10(-5.2,2) A11(-5.2,2.8) A12(-5.2,3.6) A13(-5.2,4.4) A14(-5.2,5.2) B1(-4.4,-5.2) B2(-4.4,-4.4) B3(-4.4,-3.6) B4(-4.4,-2.8) B5(-4.4,-2) B6(-4.4,-1.2) B7(-4.4,-0.4) B8(-4.4,0.4) B9(-4.4,1.2) B10(-4.4,2) B11(-4.4,2.8) B12(-4.4,3.6) B13(-4.4,4.4) B14(-4.4,5.2) C1(-3.6,-5.2) C2(-3.6,-4.4) C3(-3.6,-3.6) C4(-3.6,-2.8) C5(-3.6,-2) C6(-3.6,-1.2) C7(-3.6,-0.4) C8(-3.6,0.4) C9(-3.6,1.2) C10(-3.6,2) C11(-3.6,2.8) C12(-3.6,3.6) C13(-3.6,4.4) C14(-3.6,5.2) D1(-2.8,-5.2) D2(-2.8,-4.4) D3(-2.8,-3.6) D4(-2.8,-2.8) D5(-2.8,-2) D6(-2.8,-1.2) D7(-2.8,-0.4) D8(-2.8,0.4) D9(-2.8,1.2) D10(-2.8,2) D11(-2.8,2.8) D12(-2.8,3.6) D13(-2.8,4.4) D14(-2.8,5.2) E1(-2,-5.2) E2(-2,-4.4) E3(-2,-3.6) E4(-2,-2.8) E5(-2,-2) E6(-2,-1.2) E7(-2,-0.4) E8(-2,0.4) E9(-2,1.2) E10(-2,2) E11(-2,2.8) E12(-2,3.6) E13(-2,4.4) E14(-2,5.2) F1(-1.2,-5.2) F2(-1.2,-4.4) F3(-1.2,-3.6) F4(-1.2,-2.8) F5(-1.2,-2) F6(-1.2,-1.2) F7(-1.2,-0.4) F8(-1.2,0.4) F9(-1.2,1.2) F10(-1.2,2) F11(-1.2,2.8) F12(-1.2,3.6) F13(-1.2,4.4) F14(-1.2,5.2) G1(-0.4,-5.2) G2(-0.4,-4.4) G3(-0.4,-3.6) G4(-0.4,-2.8) G5(-0.4,-2) G6(-0.4,-1.2) G7(-0.4,-0.4) G8(-0.4,0.4) G9(-0.4,1.2) G10(-0.4,2) G11(-0.4,2.8) G12(-0.4,3.6) G13(-0.4,4.4) G14(-0.4,5.2) H1(0.4,-5.2) H2(0.4,-4.4) H3(0.4,-3.6) H4(0.4,-2.8) H5(0.4,-2) H6(0.4,-1.2) H7(0.4,-0.4) H8(0.4,0.4) H9(0.4,1.2) H10(0.4,2) H11(0.4,2.8) H12(0.4,3.6) H13(0.4,4.4) H14(0.4,5.2) J1(1.2,-5.2) J2(1.2,-4.4) J3(1.2,-3.6) J4(1.2,-2.8) J5(1.2,-2) J6(1.2,-1.2) J7(1.2,-0.4) J8(1.2,0.4) J9(1.2,1.2) J10(1.2,2) J11(1.2,2.8) J12(1.2,3.6) J13(1.2,4.4) J14(1.2,5.2) K1(2,-5.2) K2(2,-4.4) K3(2,-3.6) K4(2,-2.8) K5(2,-2) K6(2,-1.2) K7(2,-0.4) K8(2,0.4) K9(2,1.2) K10(2,2) K11(2,2.8) K12(2,3.6) K13(2,4.4) K14(2,5.2) L1(2.8,-5.2) L2(2.8,-4.4) L3(2.8,-3.6) L4(2.8,-2.8) L5(2.8,-2) L6(2.8,-1.2) L7(2.8,-0.4) L8(2.8,0.4) L9(2.8,1.2) L10(2.8,2) L11(2.8,2.8) L12(2.8,3.6) L13(2.8,4.4) L14(2.8,5.2) M1(3.6,-5.2) M2(3.6,-4.4) M3(3.6,-3.6) M4(3.6,-2.8) M5(3.6,-2) M6(3.6,-1.2) M7(3.6,-0.4) M8(3.6,0.4) M9(3.6,1.2) M10(3.6,2) M11(3.6,2.8) M12(3.6,3.6) M13(3.6,4.4) M14(3.6,5.2) N1(4.4,-5.2) N2(4.4,-4.4) N3(4.4,-3.6) N4(4.4,-2.8) N5(4.4,-2) N6(4.4,-1.2) N7(4.4,-0.4) N8(4.4,0.4) N9(4.4,1.2) N10(4.4,2) N11(4.4,2.8) N12(4.4,3.6) N13(4.4,4.4) N14(4.4,5.2) P1(5.2,-5.2) P2(5.2,-4.4) P3(5.2,-3.6) P4(5.2,-2.8) P5(5.2,-2) P6(5.2,-1.2) P7(5.2,-0.4) P8(5.2,0.4) P9(5.2,1.2) P10(5.2,2) P11(5.2,2.8) P12(5.2,3.6) P13(5.2,4.4) P14(5.2,5.2)
LGA-14L_L3.0-W2.5-P0.50-TL
  rect 0.5x0.28 smd: 1(-1.175,0.75) 2(-1.175,0.25) 3(-1.175,-0.25) 4(-1.175,-0.75) 8(1.175,-0.75) 9(1.175,-0.25) 10(1.175,0.25) 11(1.175,0.75)
  rect 0.28x0.5 smd: 5(-0.5,-0.925) 6(0,-0.925) 7(0.5,-0.925) 12(0.5,0.925) 13(0,0.925) 14(-0.5,0.925)
MICRO-USB-SMD_051N-4BH806-S
  rect 0.4x1.8 smd: 1(-1.3,1.3) 2(-0.65,1.3) 3(0,1.3) 4(0.65,1.3) 5(1.3,1.3)
  oval 1.05x1.85 hole 0.45x1.25: 6(-3.575,1.75) 7(-3.575,-1.75) 8(3.575,1.75) 9(3.575,-1.7)
OSC-SMD_4P-L3.2-W2.5-BL-OXETDLJANF-0.032768MHZ
  rect 1.4x1.2 smd: 1(-1.1,-0.85) 2(1.1,-0.85) 3(1.1,0.85) 4(-1.1,0.85)
OSC-SMD_L5.0-W3.2
  rect 1.9x2.4 smd: 1(-2.05,0) 2(2.05,0)
Pad_e32
  round 5.5 hole 3: 1(0,0)
Pad_e39
  round 5.5 hole 3: 1(0,0)
Pad_e93
  round 5.5 hole 3: 1(0,0)
Pad_e94
  round 5.5 hole 3: 1(0,0)
Pad_e238
  round 5.5 hole 3: 1(0,0)
Pad_e240
  round 5.5 hole 3: 1(0,0)
Pad_e242
  round 5.5 hole 3: 1(0,0)
Pad_e320
  round 5.5 hole 3: 1(0,0)
Pad_e321
  round 5.5 hole 3: 1(0,0)
Pad_e323
  round 5.5 hole 3: 1(0,0)
Pad_e450
  round 5.5 hole 3: 1(0,0)
Pad_e511
  round 5.5 hole 3: 1(0,0)
R0402
  rect 0.566x0.54 smd: 1(-0.433,0) 2(0.433,0)
RES-SMD_L6.4-W3.2-R2512
  rect 2x3.3 smd: 1(-3.067,0) 2(3.067,0)
RJ45-TH_RJHSE5384
  round 1.524 hole 0.89: 1(3.58,-3.3) 2(2.56,-1.52) 3(1.54,-3.3) 4(0.52,-1.52) 5(-0.5,-3.3) 6(-1.52,-1.52) 7(-2.54,-3.3) 8(-3.56,-1.52) 9(6.86,3.3) 10(4.57,3.3) 11(-4.57,3.3) 12(-6.86,3.3)
  round 2.5 hole 1.57: 13(-8.13,-2.41) 14(8.13,-2.41)
SOIC-16_L9.9-W3.9-P1.27-LS6.0-BL
  oval 0.602x1.971 smd: 1(-4.445,-2.736) 2(-3.175,-2.736) 3(-1.905,-2.736) 4(-0.635,-2.736) 5(0.635,-2.736) 6(1.905,-2.736) 7(3.175,-2.736) 8(4.445,-2.736) 9(4.445,2.736) 10(3.175,2.736) 11(1.905,2.736) 12(0.635,2.736) 13(-0.635,2.736) 14(-1.905,2.736) 15(-3.175,2.736) 16(-4.445,2.736)
SON-22_L5.0-W6.0-P0.50-CSD88599Q5DCT
  rect 0.7x0.25 smd: 1(-2.35,2.5) 2(-2.35,2) 21(2.35,2) 22(2.35,2.5)
  rect 0.45x0.25 smd: 3(-2.475,1.5) 4(-2.475,1) 5(-2.475,0.5) 6(-2.475,0) 7(-2.475,-0.5) 8(-2.475,-1) 9(-2.475,-1.5) 10(-2.475,-2) 11(-2.475,-2.5) 12(2.475,-2.5) 13(2.475,-2) 14(2.475,-1.5) 15(2.475,-1) 16(2.475,-0.5) 17(2.475,0) 18(2.475,0.5) 19(2.475,1) 20(2.475,1.5)
  rect 0.25x4.25 smd: 11(-2.175,-0.5) 20(2.175,-0.5)
  rect 0.43x0.375 smd: 23(-2.115,3.013) 24(-2.135,-3.013) 25(2.115,-3.013) 26(2.135,3.013)
  rect 3.3x5.4 smd: 27(0,0)
SOT-23-3_L2.9-W1.3-P1.90-LS2.4-BR
  rect 1.25x0.7 smd: 1(1,-0.95) 2(1,0.95) 3(-1,0)
SOT-23-3_L2.9-W1.3-P1.90-LS2.4-BR-1
  rect 1.25x0.7 smd: 1(1,-0.95) 2(1,0.95) 3(-1,0)
SOT-23-5_L2.9-W1.6-P0.95-LS2.8-BL
  rect 0.6x1 smd: 1(-0.95,-1.1) 2(0,-1.1) 3(0.95,-1.1) 4(0.95,1.1) 5(-0.95,1.1)
SOT-23-5_L2.9-W1.6-P0.95-LS2.8-BR
  rect 1x0.6 smd: 1(1.1,-0.95) 2(1.1,0) 3(1.1,0.95) 4(-1.1,0.95) 5(-1.1,-0.95)
SOT-23-6_L2.9-W1.6-P0.95-LS2.8-BR
  rect 1.1x0.6 smd: 1(1.35,-0.95) 2(1.35,0) 3(1.35,0.95) 4(-1.35,0.95) 5(-1.35,0) 6(-1.35,-0.95)
SW-SMD_4P-L5.1-W5.1-P3.70-LS6.5-TL_H1.5
  rect 1x0.75 smd: 1(-3,1.875) 2(3,1.875) 3(-3,-1.875) 4(3,-1.875)
TF-SMD_A-MICROTF-1.85A
  rect 0.7x1.6 smd: 1(2.2,5.05) 2(1.1,5.05) 3(0,5.05) 4(-1.1,5.05) 5(-2.2,5.05) 6(-3.3,5.05) 7(-4.4,5.05) 8(-5.5,5.05) 9(-6.6,5.05)
  rect 1.2x1.6 smd: 10(-7.75,4.45)
  rect 1.2x2.2 smd: 10(-7.75,-5.05) 10(7.75,-5.05)
  rect 1.6x1.4 smd: 10(6.85,4.55)
TSSOP-14_L4.9-W4.4-P0.65-LS6.4-BL
  oval 0.364x1.56 smd: 1(-1.95,-2.78) 2(-1.3,-2.78) 3(-0.65,-2.78) 4(0,-2.78) 5(0.65,-2.78) 6(1.3,-2.78) 7(1.95,-2.78) 8(1.95,2.78) 9(1.3,2.78) 10(0.65,2.78) 11(0,2.78) 12(-0.65,2.78) 13(-1.3,2.78) 14(-1.95,2.78)
TSSOP-14_L5.0-W4.4-P0.65-LS6.4-BL
  rect 0.4x1.7 smd: 1(-1.95,-2.8) 2(-1.3,-2.8) 3(-0.65,-2.8) 4(0,-2.8) 5(0.65,-2.8) 6(1.3,-2.8) 7(1.95,-2.8) 8(1.95,2.8) 9(1.3,2.8) 10(0.65,2.8) 11(0,2.8) 12(-0.65,2.8) 13(-1.3,2.8) 14(-1.95,2.8)
TUMD2M_L2.0-W1.4-LS2.5-RD
  rect 1.8x1.1 smd: 1(-0.8,0)
  rect 0.8x1.1 smd: 2(0.8,0)
VQFN-40_L6.0-W6.0-P0.50-TL-EP
  rect 0.665x0.28 smd: 1(-2.908,2.25) 2(-2.908,1.75) 3(-2.908,1.25) 4(-2.908,0.75) 5(-2.908,0.25) 6(-2.908,-0.25) 7(-2.908,-0.75) 8(-2.908,-1.25) 9(-2.908,-1.75) 10(-2.908,-2.25) 21(2.908,-2.25) 22(2.908,-1.75) 23(2.908,-1.25) 24(2.908,-0.75) 25(2.908,-0.25) 26(2.908,0.25) 27(2.908,0.75) 28(2.908,1.25) 29(2.908,1.75) 30(2.908,2.25)
  rect 0.28x0.665 smd: 11(-2.25,-2.908) 12(-1.75,-2.908) 13(-1.25,-2.908) 14(-0.75,-2.908) 15(-0.25,-2.908) 16(0.25,-2.908) 17(0.75,-2.908) 18(1.25,-2.908) 19(1.75,-2.908) 20(2.25,-2.908) 31(2.25,2.908) 32(1.75,2.908) 33(1.25,2.908) 34(0.75,2.908) 35(0.25,2.908) 36(-0.25,2.908) 37(-0.75,2.908) 38(-1.25,2.908) 39(-1.75,2.908) 40(-2.25,2.908)
  rect 3.52x2.62 smd: 41(0,0)
VSON-8_L2.0-W1.5-P0.50-BL
  rect 0.25x0.55 smd: 1(-0.75,-0.675) 2(-0.25,-0.675) 3(0.25,-0.675) 4(0.75,-0.675) 5(0.75,0.675) 6(0.25,0.675) 7(-0.25,0.675) 8(-0.75,0.675)
VSSOP-8_L2.4-W2.1-P0.50-LS3.2-BR
  oval 0.75x0.25 smd: 1(1.55,-0.75) 2(1.55,-0.25) 3(1.55,0.25) 4(1.55,0.75) 5(-1.55,0.75) 6(-1.55,0.25) 7(-1.55,-0.25) 8(-1.55,-0.75)
WSON-8_L6.0-W5.0-P1.27-BL-EP
  oval 0.581x1.276 smd: 1(-1.905,-3.013) 2(-0.635,-3.013) 3(0.635,-3.013) 4(1.905,-3.013) 5(1.905,3.013) 6(0.635,3.013) 7(-0.635,3.013) 8(-1.905,3.013)
  rect 4.3x3.4 smd: 9(0,0)
X2SON-4_L1.0-W1.0-P0.65-TL-EP
  custom 0.36x0.22 smd: 1(-0.43,0.325) 2(-0.43,-0.325) 3(0.43,-0.325) 4(0.43,0.325)
  rect 0.48x0.48 smd rot 135: 5(0,0)

## Nets
1.1V: C67.2 C72.2 C140.2 C141.1 C142.1 C143.1 C144.1 C145.1 U9.8 U10.2 U24.E4 U24.F7 U24.F9 U24.G5 U24.G8 U24.G9 U24.H6 U24.J6
1.2VA: C75.2 C132.2 C133.1 C134.1 C135.2 U24.C3 U24.E6 U24.E8 U24.E10 U24.G4 U24.G10 U27.5
1.8V: C77.2 C136.2 C137.1 C152.2 C153.2 R35.2 R36.2 R37.2 R38.2 R39.2 R46.2 U13.2 U24.F10 U26.14 U31.5
2.5V: C79.2 C138.2 C139.1 U22.1 U24.E7 U24.E9
3.3V: C16.2 C17.2 C19.2 C20.2 C21.2 C22.2 C23.2 C24.2 C28.2 C30.1 C33.1 C48.1 C49.1 C50.1 C61.1 C74.1 C76.1 C78.1 C80.2 C100.2 C101.2 C102.1 C103.1 C104.1 C111.1 C112.1 C117.2 C119.1 C146.1 C147.2 C148.1 C149.1 C150.1 C151.1 FPC1.1 FPC2.1 H1.1 H3.2 H3.4 H3.10 H3.18 H7.1 H7.3 H25.2 H26.2 L8.2 R1.2 R2.2 R18.2 R23.1 R25.2 R26.2 R27.2 R28.2 R40.1 R41.1 R42.1 R43.1 R44.1 R45.1 R56.2 R58.2 R60.2 R62.2 R64.2 R66.2 R68.2 R70.2 R72.2 R74.1 R75.1 R76.1 R79.2 R84.1 R87.2 R119.1 RJ1.10 RJ1.12 RJ2.12 SW1.4 U2.E6 U2.E9 U2.F5 U2.F10 U2.J6 U2.J10 U2.K4 U2.K5 U2.M9 U2.P12 U3.4 U5.16 U6.1 U7.6 U7.19 U11.8 U13.7 U13.8 U14.1 U15.1 U16.1 U17.6 U17.19 U18.4 U19.8 U22.3 U22.4 U23.5 U24.F4 U24.H4 U24.H5 U24.H7 U24.H8 U24.H9 U24.H10 U24.J4 U24.J5 U24.J9 U24.J10 U25.4 U27.1 U27.3 U31.1 U31.3 U82.1 U87.1 U88.1 U89.1 U94.2 U94.3 U94.5 U94.8 X5.4
3.3V-1: C12.2 C55.2 U35.1 U86.2 U86.3 U86.5 U86.8
3.3V-2: C96.2 C97.2 U90.2 U90.3 U90.5 U90.8 U91.1
3.3V-3: C98.2 C99.2 U92.2 U92.3 U92.5 U92.8 U93.1
5.0V: C25.2 C26.2 C60.1 C62.1 C63.1 C73.1 H4.1 H5.1 H6.1 L1.2 L11.2 Q1.2 R21.2 R96.2 U2.P6 U23.1 U79.1 U80.1 U81.1
36V: C6.1 C7.2 C8.2 C9.2 C10.2 C11.2 C13.2 C14.2 C15.2 C18.2 C59.2 C68.1 C69.1 C70.1 C81.2 C83.2 C86.1 U1.27 U12.4 U12.5 U20.4 U20.5 U21.4 U21.5 U32.27 U33.27 U34.27 U50.27 U51.27 U52.27 U54.27 U56.27 U83.1
GND: C1.2 C2.2 C3.2 C4.2 C5.2 C6.2 C7.1 C8.1 C9.1 C10.1 C11.1 C13.1 C14.1 C15.1 C16.1 C17.1 C18.1 C19.1 C20.1 C21.1 C22.1 C23.1 C24.1 C25.1 C26.1 C27.1 C28.1 C29.1 C30.2 C31.1 C32.2 C33.2 C34.2 C35.2 C36.1 C37.1 C38.1 C39.1 C40.2 C41.2 C42.2 C43.2 C44.2 C45.2 C46.2 C47.2 C48.2 C49.2 C50.2 C56.2 C57.2 C58.1 C60.2 C61.2 C62.2 C63.2 C65.1 C67.1 C68.2 C69.2 C70.2 C71.1 C72.1 C73.2 C74.2 C75.1 C76.2 C77.1 C78.2 C79.1 C80.1 C85.2 C86.2 C87.2 C88.2 C89.2 C90.2 C91.2 C92.2 C93.2 C94.2 C95.2 C100.1 C101.1 C102.2 C103.2 C104.2 C109.1 C110.1 C111.2 C112.2 C115.2 C117.1 C119.2 C120.2 C121.2 C122.2 C123.2 C124.2 C125.2 C126.2 C127.2 C132.1 C133.2 C134.2 C135.1 C136.1 C137.2 C138.1 C139.2 C140.1 C141.2 C142.2 C143.2 C144.2 C145.2 C146.2 C147.1 C148.2 C149.2 C150.2 C151.2 C152.1 C153.1 FPC1.6 FPC1.9 FPC1.12 FPC1.15 FPC1.16 FPC1.17 FPC2.6 FPC2.9 FPC2.12 FPC2.15 FPC2.16 FPC2.17 H1.2 H3.1 H3.5 H3.6 H3.14 H3.22 H4.2 H5.2 H6.2 H7.2 H7.4 LED1.1 LED2.1 LED3.1 LED4.1 NOREF#2.1 NOREF#3.1 NOREF#4.1 NOREF#5.1 NOREF#6.1 NOREF#7.1 NOREF#8.1 NOREF#10.1 NOREF#12.1 Q1.1 Q2.2 Q3.2 R3.1 R4.1 R5.1 R6.1 R7.1 R8.2 R9.1 R10.1 R11.2 R12.1 R13.1 R14.1 R15.1 R19.1 R20.1 R24.1 R29.1 R77.2 R78.2 R82.1 R83.1 RJ1.13 RJ1.14 RJ2.9 RJ2.13 RJ2.14 U2.A1 U2.A14 U2.B5 U2.B10 U2.E2 U2.E13 U2.G7 U2.G8 U2.H7 U2.H8 U2.J7 U2.J8 U2.K2 U2.K6 U2.K9 U2.K13 U2.L9 U2.N1 U2.N2 U2.N5 U2.N8 U2.P1 U2.P14 U3.11 U4.2 U5.9 U5.14 U6.2 U7.9 U7.21 U7.25 U9.1 U11.4 U12.10 U12.11 U12.20 U12.32 U12.40 U12.41 U13.1 U14.2 U15.2 U16.7 U16.8 U17.9 U17.21 U17.25 U18.6 U18.10 U19.4 U20.10 U20.11 U20.20 U20.32 U20.40 U20.41 U21.10 U21.11 U21.20 U21.32 U21.40 U21.41 U22.2 U22.5 U24.A1 U24.A13 U24.C11 U24.D3 U24.D11 U24.E2 U24.E5 U24.E12 U24.F5 U24.F6 U24.F8 U24.G6 U24.G7 U24.J7 U24.J8 U24.K2 U24.K12 U24.L12 U24.M4 U24.N1 U24.N13 U25.11 U26.7 U27.2 U31.2 U47.2 U79.2 U80.2 U81.2 U82.3 U87.2 U88.2 U89.2 U94.6 U94.7 U95.2 USB1.5 USB1.6 USB1.7 USB1.8 USB1.9 X5.1 X5.2
GND-1: C12.1 C55.1 U35.2 U86.6 U86.7
GND-2: C96.1 C97.1 U90.6 U90.7 U91.2
GND-3: C98.1 C99.1 NOREF#9.1 U92.6 U92.7 U93.2
VDD_SOC_IN: C40.1 C41.1 C42.1 C43.1 L4.2 U2.F6 U2.F7 U2.F8 U2.F9 U2.G6 U2.G9 U2.H6 U2.H9 U2.J5 U2.J9
VDDA_ADC_3P3: H7.16 U2.N14
$1I69294\A1-VCO: H3.3 R48.2
$1I69294\A1-VSI: H3.7 R49.2
$1I69294\A1-VTEM: H3.8 R47.2
$1I69294\A2-VCO: H3.11 R51.2
$1I69294\A2-VSI: H3.15 R52.2
$1I69294\A2-VTEM: H3.16 R50.2
$1I69294\A3-VCO: H3.19 R54.2
$1I69294\A3-VSI: H3.23 R55.2
$1I69294\A3-VTEM: H3.24 R53.2
$1I69294\G-CS-1: U35.4 U86.12
$1I69294\G-CS-2: U90.12 U91.4
$1I69294\G-CS-3: U92.12 U93.4
$1I69294\MISO-SDO-1: U35.3 U86.1
$1I69294\MISO-SDO-2: U90.1 U91.3
$1I69294\MISO-SDO-3: U92.1 U93.3
$1I69294\MOSI-SDI-1: U35.5 U86.14
$1I69294\MOSI-SDI-2: U90.14 U91.5
$1I69294\MOSI-SDI-3: U92.14 U93.5
$1I69294\SCLK-1: U35.7 U86.13
$1I69294\SCLK-2: U90.13 U91.7
$1I69294\SCLK-3: U92.13 U93.7
$1I78243\$1N2148: C84.2 U20.2
$1I78243\$1N2149: C83.1 U20.3
$1I78243\$1N2150: C84.1 U20.1
$1I78243\$1N2153: C81.1 U12.3
$1I78243\$1N2154: C82.2 U12.2
$1I78243\$1N2155: C82.1 U12.1
$1I78243\$1N2170: C59.1 U21.3
$1I78243\$1N2171: C66.1 U21.1
$1I78243\$1N2172: C66.2 U21.2
$1I78243\$1N6352: C3.1 U21.24
$1I78243\$1N6618: C4.1 U21.33
$1I78243\$1N6708: C5.1 U12.33
$1I78243\$1N6714: C85.1 U12.24
$1I78243\$1N9886: U32.3 U32.4 U32.5 U32.6 U32.7 U32.8 U32.9 U32.10 U32.11 U49.1
$1I78243\$1N10035: U33.3 U33.4 U33.5 U33.6 U33.7 U33.8 U33.9 U33.10 U33.11 U49.2
$1I78243\$1N10055: U34.3 U34.4 U34.5 U34.6 U34.7 U34.8 U34.9 U34.10 U34.11 U49.3
$1I78243\$1N10902: U50.3 U50.4 U50.5 U50.6 U50.7 U50.8 U50.9 U50.10 U50.11 U53.1
$1I78243\$1N10928: U52.3 U52.4 U52.5 U52.6 U52.7 U52.8 U52.9 U52.10 U52.11 U53.3
$1I78243\$1N10963: U51.3 U51.4 U51.5 U51.6 U51.7 U51.8 U51.9 U51.10 U51.11 U53.2
$1I78243\$1N15383: U56.3 U56.4 U56.5 U56.6 U56.7 U56.8 U56.9 U56.10 U56.11 U57.3
$1I78243\$1N15409: U1.3 U1.4 U1.5 U1.6 U1.7 U1.8 U1.9 U1.10 U1.11 U57.2
$1I78243\$1N15447: U54.3 U54.4 U54.5 U54.6 U54.7 U54.8 U54.9 U54.10 U54.11 U57.1
$1I78243\$1N15620: C57.1 U20.24
$1I78243\$1N15622: C56.1 U20.33
$1I78243\M1-GHA: U21.6 U32.1
$1I78243\M1-GHB: U21.15 U33.1
$1I78243\M1-GHC: U21.16 U34.1
$1I78243\M1-GLA: U21.8 U32.22
$1I78243\M1-GLB: U21.13 U33.22
$1I78243\M1-GLC: U21.18 U34.22
$1I78243\M1-SHA: U21.7 U32.2
$1I78243\M1-SHB: U21.14 U33.2
$1I78243\M1-SHC: U21.17 U34.2
$1I78243\M1-SPA: R3.2 U21.9 U32.12 U32.13 U32.14 U32.15 U32.16 U32.17 U32.18 U32.19 U32.20
$1I78243\M1-SPB: R14.2 U21.12 U33.12 U33.13 U33.14 U33.15 U33.16 U33.17 U33.18 U33.19 U33.20
$1I78243\M1-SPC: R10.2 U21.19 U34.12 U34.13 U34.14 U34.15 U34.16 U34.17 U34.18 U34.19 U34.20
$1I78243\M2-GHA: U12.6 U50.1
$1I78243\M2-GHB: U12.15 U51.1
$1I78243\M2-GHC: U12.16 U52.1
$1I78243\M2-GLA: U12.8 U50.22
$1I78243\M2-GLB: U12.13 U51.22
$1I78243\M2-GLC: U12.18 U52.22
$1I78243\M2-SHA: U12.7 U50.2
$1I78243\M2-SHB: U12.14 U51.2
$1I78243\M2-SHC: U12.17 U52.2
$1I78243\M2-SPA: R6.2 U12.9 U50.12 U50.13 U50.14 U50.15 U50.16 U50.17 U50.18 U50.19 U50.20
$1I78243\M2-SPB: R5.2 U12.12 U51.12 U51.13 U51.14 U51.15 U51.16 U51.17 U51.18 U51.19 U51.20
$1I78243\M2-SPC: R4.2 U12.19 U52.12 U52.13 U52.14 U52.15 U52.16 U52.17 U52.18 U52.19 U52.20
$1I78243\M3-GHA: U20.6 U54.1
$1I78243\M3-GHB: U1.1 U20.15
$1I78243\M3-GHC: U20.16 U56.1
$1I78243\M3-GLA: U20.8 U54.22
$1I78243\M3-GLB: U1.22 U20.13
$1I78243\M3-GLC: U20.18 U56.22
$1I78243\M3-SHA: U20.7 U54.2
$1I78243\M3-SHB: U1.2 U20.14
$1I78243\M3-SHC: U20.17 U56.2
$1I78243\M3-SPA: R15.2 U20.9 U54.12 U54.13 U54.14 U54.15 U54.16 U54.17 U54.18 U54.19 U54.20
$1I78243\M3-SPB: R20.2 U1.12 U1.13 U1.14 U1.15 U1.16 U1.17 U1.18 U1.19 U1.20 U20.12
$1I78243\M3-SPC: R7.2 U20.19 U56.12 U56.13 U56.14 U56.15 U56.16 U56.17 U56.18 U56.19 U56.20
$1I162614\$1I20948\$1N1357: C113.2 R97.1 U3.3
$1I162614\$1I20948\$1N1364: C113.1 R33.1 U3.2
$1I162614\$1I20948\$1N2103: C114.2 R99.1 U3.5
$1I162614\$1I20948\$1N2107: C114.1 R98.1 U3.6
$1I162614\$1I20948\$1N2226: C116.2 R101.1 U3.10
$1I162614\$1I20948\$1N2230: C116.1 R100.1 U3.9
$1I162614\$1I20948\$1N2349: C118.2 R103.1 U3.12
$1I162614\$1I20948\$1N2353: C118.1 R102.1 U3.13
$1I162614\$1I20948\$1N3032: C131.2 R111.1 U25.12
$1I162614\$1I20948\$1N3036: C131.1 R110.1 U25.13
$1I162614\$1I20948\$1N3040: C129.2 R107.1 U25.5
$1I162614\$1I20948\$1N3044: C129.1 R106.1 U25.6
$1I162614\$1I20948\$1N3050: C130.2 R109.1 U25.10
$1I162614\$1I20948\$1N3054: C130.1 R108.1 U25.9
$1I162614\$1I20948\$1N3063: C128.2 R105.1 U25.3
$1I162614\$1I20948\$1N3071: C128.1 R104.1 U25.2
$1I162614\$1I20948\$1N3551: C123.1 R112.2 U5.5
$1I162614\$1I20948\$1N3554: R112.1 U25.1
$1I162614\$1I20948\$1N3595: C124.1 R34.2 U5.4
$1I162614\$1I20948\$1N3598: R34.1 U3.14
$1I162614\$1I20948\$1N3638: R113.1 U3.1
$1I162614\$1I20948\$1N3640: C127.1 R113.2 U5.1
$1I162614\$1I20948\$1N3680: R114.1 U3.7
$1I162614\$1I20948\$1N3682: C126.1 R114.2 U5.2
$1I162614\$1I20948\$1N3722: R115.1 U3.8
$1I162614\$1I20948\$1N3724: C125.1 R115.2 U5.3
$1I162614\$1I20948\$1N3764: R116.1 U25.7
$1I162614\$1I20948\$1N3766: C122.1 R116.2 U5.6
$1I162614\$1I20948\$1N3806: R117.1 U25.8
$1I162614\$1I20948\$1N3808: C121.1 R117.2 U5.7
$1I162614\$1I20948\$1N3848: R118.1 U25.14
$1I162614\$1I20948\$1N3850: C120.1 R118.2 U5.8
$1I162614\$1I20948\+2.5VREF: C115.1 R119.2 U4.1 U5.15
$1I162614\$1I20948\AIN0_N: H1.4 R33.2
$1I162614\$1I20948\AIN0_P: H1.3 R97.2
$1I162614\$1I20948\AIN1_N: H1.6 R98.2
$1I162614\$1I20948\AIN1_P: H1.5 R99.2
$1I162614\$1I20948\AIN2_N: H1.8 R100.2
$1I162614\$1I20948\AIN2_P: H1.7 R101.2
$1I162614\$1I20948\AIN3_N: H1.10 R102.2
$1I162614\$1I20948\AIN3_P: H1.9 R103.2
$1I162614\$1I20948\AIN4_N: H1.12 R104.2
$1I162614\$1I20948\AIN4_P: H1.11 R105.2
$1I162614\$1I20948\AIN5_N: H1.14 R106.2
$1I162614\$1I20948\AIN5_P: H1.13 R107.2
$1I162614\$1I20948\AIN6_N: H1.16 R108.2
$1I162614\$1I20948\AIN6_P: H1.15 R109.2
$1I162614\$1I20948\AIN7_N: H1.18 R110.2
$1I162614\$1I20948\AIN7_P: H1.17 R111.2
$1I162614\$1N1792: R82.2 U9.5
$1I162614\$1N1953: C65.2 L1.1 U9.2 U9.4
$1I162614\$1N2025: R83.2 U9.3
$1I162614\$1N2131: U9.7 U10.1
$1I162614\$1N15864: R86.2 U26.3
